# EAGLE design BMW_final (EAGLE 6.4)
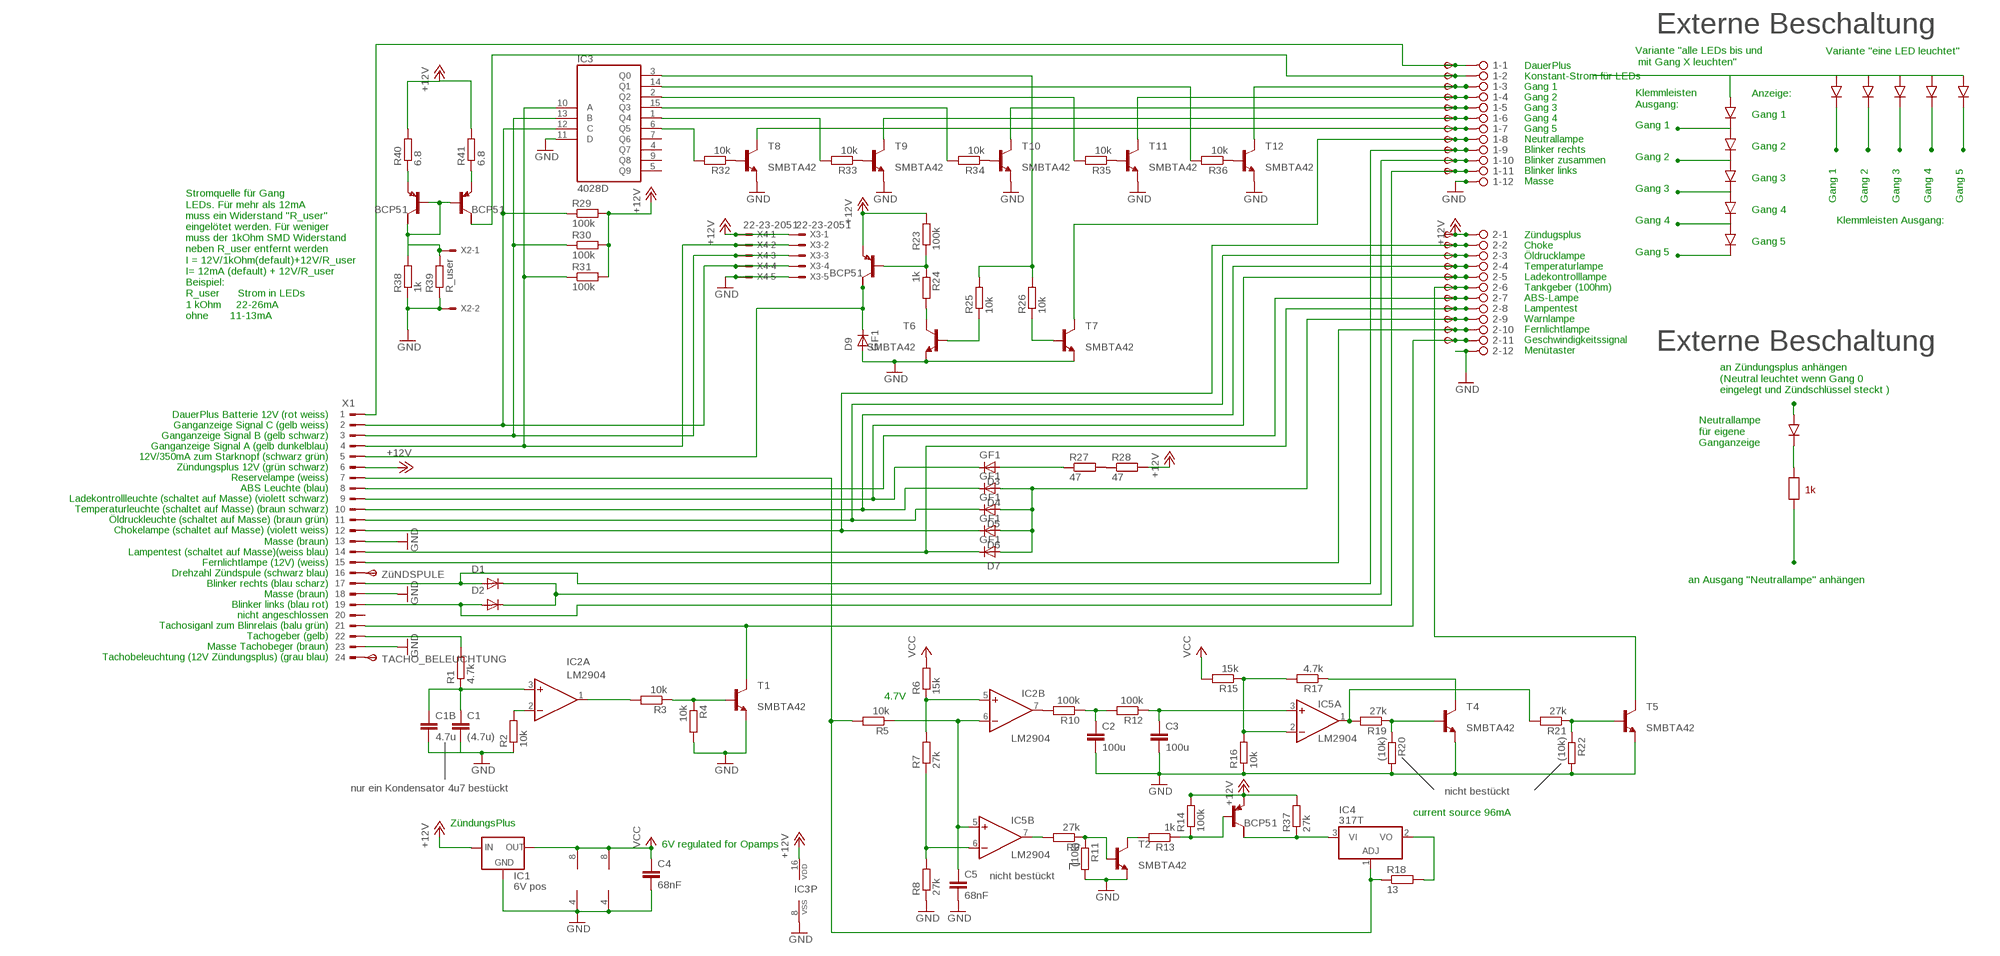
[diagram p0: schematic, sheet 1]

## Parts
1  2081-1132  [12-PIN]
2  2081-1132  [12-PIN]
C1  (4.7u)  C-EUC1206  [C1206]
C1B  4.7u  C-EUC0805K  [C0805K]
C2  100u  C-EUC1206K  [C1206K]
C3  100u  C-EUC1206K  [C1206K]
C4  68nF  C-EUC1206K  [C1206K]
C5  68nF  C-EUC1206K  [C1206K]
D1  GF1  [SMA-DO214AC]
D2  GF1  [SMA-DO214AC]
D3  GF1  [SMA-DO214AC]
D4  GF1  [SMA-DO214AC]
D5  GF1  [SMA-DO214AC]
D6  GF1  [SMA-DO214AC]
D7  GF1  [SMA-DO214AC]
D9  GF1  [SMA-DO214AC]
IC1  6V pos  78LXX  [78LXX]
IC2  LM2904  LM358D  [SO08]
IC3  4028D  [SO16]
IC4  317T  [TO220H]
IC5  LM2904  LM358D  [SO08]
R1  4.7k  R-EU_R0805  [R0805]
R2  10k  R-EU_R0805  [R0805]
R3  10k  R-EU_R0805  [R0805]
R4  10k  R-EU_R0805  [R0805]
R5  10k  R-EU_R0805  [R0805]
R6  15k  R-EU_R0805  [R0805]
R7  27k  R-EU_R0805  [R0805]
R8  27k  R-EU_R0805  [R0805]
R9  27k  R-EU_R0805  [R0805]
R10  100k  R-EU_R0805  [R0805]
R11  (10k)  R-EU_R0805  [R0805]
R12  100k  R-EU_R0805  [R0805]
R13  1k  R-EU_R0805  [R0805]
R14  100k  R-EU_R0805  [R0805]
R15  15k  R-EU_R0805  [R0805]
R16  10k  R-EU_R0805  [R0805]
R17  4.7k  R-EU_R0805  [R0805]
R18  13  R-EU_0207/10  [0207/10]
R19  27k  R-EU_R0805  [R0805]
R20  (10k)  R-EU_R0805  [R0805]
R21  27k  R-EU_R0805  [R0805]
R22  (10k)  R-EU_R0805  [R0805]
R23  100k  R-EU_R0805  [R0805]
R24  1k  R-EU_R0805  [R0805]
R25  10k  R-EU_R0805  [R0805]
R26  10k  R-EU_R0805  [R0805]
R27  47  R-EU_V235/17  [V235/17]
R28  47  R-EU_V235/17  [V235/17]
R29  100k  R-EU_R0805  [R0805]
R30  100k  R-EU_R0805  [R0805]
R31  100k  R-EU_R0805  [R0805]
R32  10k  R-EU_R0805  [R0805]
R33  10k  R-EU_R0805  [R0805]
R34  10k  R-EU_R0805  [R0805]
R35  10k  R-EU_R0805  [R0805]
R36  10k  R-EU_R0805  [R0805]
R37  27k  R-EU_R0805  [R0805]
R38  1k  R-EU_R0805  [R0805]
R39  R_user  R-EU_R0805  [R0805]
R40  6.8  R-EU_R0805  [R0805]
R41  6.8  R-EU_R0805  [R0805]
T  BCP53T1  [SOT223]
T1  MMBTA42LT1-NPN-SOT23-BEC  [SOT23-BEC]
T2  MMBTA42LT1-NPN-SOT23-BEC  [SOT23-BEC]
T3  BCP53T1  [SOT223]
T4  MMBTA42LT1-NPN-SOT23-BEC  [SOT23-BEC]
T5  MMBTA42LT1-NPN-SOT23-BEC  [SOT23-BEC]
T6  MMBTA42LT1-NPN-SOT23-BEC  [SOT23-BEC]
T7  MMBTA42LT1-NPN-SOT23-BEC  [SOT23-BEC]
T8  MMBTA42LT1-NPN-SOT23-BEC  [SOT23-BEC]
T9  MMBTA42LT1-NPN-SOT23-BEC  [SOT23-BEC]
T10  MMBTA42LT1-NPN-SOT23-BEC  [SOT23-BEC]
T11  MMBTA42LT1-NPN-SOT23-BEC  [SOT23-BEC]
T12  MMBTA42LT1-NPN-SOT23-BEC  [SOT23-BEC]
T13  BCP53T1  [SOT223]
T14  BCP53T1  [SOT223]
TACHO_BELEUCHTUNG  TPSP1_1MM  [P1_1.0MM]
TP1  TPSB1,27  [B1,27]
TP2  TPSB1,27  [B1,27]
TP3  TPSB1,27  [B1,27]
TP4  TPSB1,27  [B1,27]
TP5  TPSB1,27  [B1,27]
TP6  TPSB1,27  [B1,27]
TP7  TPSB1,27  [B1,27]
TP8  TPSB1,27  [B1,27]
TP9  TPSB1,27  [B1,27]
TP10  TPSB1,27  [B1,27]
TP11  TPSB1,27  [B1,27]
TP12  TPSB1,27  [B1,27]
TP16  TPSB1,27  [B1,27]
TP17  TPSB1,27  [B1,27]
TP18  TPSB1,27  [B1,27]
TP19  TPSB1,27  [B1,27]
TP21  TPSB1,27  [B1,27]
TP22  TPSB1,27  [B1,27]
TP23  TPSB1,27  [B1,27]
TP24  TPSB1,27  [B1,27]
TP25  TPSB1,27  [B1,27]
TP26  TPSB1,27  [B1,27]
X1  CON_BMW  [24-PIN]
X2  22-23-2021  [22-23-2021]
X3  22-23-2051  [22-23-2051]
X4  22-23-2051  [22-23-2051]
ZüNDSPULE  TPSP1_1MM  [P1_1.0MM]

## Nets
+12V: 2.1 IC1.IN IC3.16(VDD) R14.2 R23.2 R28.2 R29.2 R30.2 R31.2 R37.2 R40.2 R41.2 T3.3(E) T.3(E) TP12.TP(PP) X1.6 X3.1 X4.1
GND: 1.12 2.12 C1.2 C1B.2 C2.2 C3.2 C4.2 C5.2 D9.A IC1.GND IC2.4(P:V-) IC3.8(VSS) IC3.11(D) IC5.4(P:V-) R2.1 R4.2 R8.1 R11.2 R16.1 R20.2 R22.2 R38.1 R39.1 T1.E T2.E T4.E T5.E T6.E T7.E T8.E T9.E T10.E T11.E T12.E X1.13 X1.18 X1.23 X2.2 X3.5 X4.5
N$1: 2.9 D4.A D5.A D6.A D7.A TP24.TP(PP)
N$2: IC3.10(A) R31.1 X1.4 X3.2 X4.2
N$3: IC3.13(B) R30.1 X1.3 X3.3 X4.3
N$4: 2.7 TP22.TP(PP) X1.8
N$5: R25.1 T6.B
N$6: IC3.3(Q0) R25.2 R26.2
N$7: R24.2 T6.C
N$8: R27.2 R28.1
N$9: R23.1 R24.1 T.1(B)
N$10: R26.1 T7.B
N$11: D9.K(C) T.2(C) X1.5
N$12: 2.2 D6.K(C) TP16.TP(PP) X1.12
N$13: 2.3 D5.K(C) TP17.TP(PP) X1.11
N$14: 2.4 D4.K(C) TP18.TP(PP) X1.10
N$15: IC4.1(ADJ) R5.2 R18.1 X1.7
N$16: C5.1 IC2.6(B:-IN) IC5.5(B:+IN) R5.1
N$17: IC3.12(C) R29.1 X1.2 X3.4 X4.4
N$18: R32.1 T8.B
N$19: 2.8 D7.K(C) TP23.TP(PP) X1.14
N$20: 1.9 D1.A TP9.TP(PP) X1.17
N$21: 1.11 D2.A TP11.TP(PP) X1.19
N$22: 1.10 D1.K(C) D2.K(C) TP10.TP(PP)
N$23: R1.2 X1.22
N$24: C1.1 C1B.1 IC2.3(A:+IN) R1.1
N$25: IC2.2(A:-IN) R2.2
N$26: 2.11 T1.C TP26.TP(PP) X1.21
N$27: IC2.1(A:OUT) R3.2
N$28: R3.1 R4.1 T1.B
N$29: IC4.2(VO) R18.2
N$30: IC5.6(B:-IN) R7.1 R8.2
N$31: IC5.7(B:OUT) R9.2
N$32: R13.2 T2.C
N$34: R9.1 R11.1 T2.B
N$35: IC4.3(VI) R37.1 T3.2(C)
N$36: R13.1 R14.1 T3.1(B)
N$37: IC3.14(Q1) R36.2
N$38: IC3.2(Q2) R35.2
N$39: 1.5 T10.C TP5.TP(PP)
N$40: IC2.5(B:+IN) R6.1 R7.2
N$41: IC2.7(B:OUT) R10.2
N$42: X1.16 ZüNDSPULE.TP(PP)
N$43: IC5.1(A:OUT) R19.2 R21.2
N$44: R19.1 R20.1 T4.B
N$45: C2.1 R10.1 R12.2
N$46: C3.1 IC5.3(A:+IN) R12.1
N$47: IC5.2(A:-IN) R15.1 R16.2 R17.2
N$48: R21.1 R22.1 T5.B
N$49: R17.1 T4.C
N$50: 1.6 T9.C TP6.TP(PP)
N$51: R34.1 T10.B
N$52: 1.8 T7.C TP8.TP(PP)
N$53: 2.10 TP25.TP(PP) X1.15
N$54: D3.A R27.1
N$55: 2.5 D3.K(C) TP19.TP(PP) X1.9
N$56: R33.1 T9.B
N$57: R35.1 T11.B
N$58: TACHO_BELEUCHTUNG.TP(PP) X1.24
N$59: 1.2 T14.2(C) TP2.TP(PP)
N$60: 2.6 T5.C TP21.TP(PP)
N$61: IC3.6(Q5) R32.2
N$62: R36.1 T12.B
N$63: 1.7 T8.C TP7.TP(PP)
N$64: IC3.1(Q4) R33.2
N$65: IC3.15(Q3) R34.2
N$66: 1.4 T11.C TP4.TP(PP)
N$67: 1.3 T12.C TP3.TP(PP)
N$68: R38.2 R39.2 T13.1(B) T13.2(C) T14.1(B) X2.1
N$69: 1.1 TP1.TP(PP) X1.1
N$75: R40.1 T13.3(E)
N$83: R41.1 T14.3(E)
VCC: C4.1 IC1.OUT IC2.8(P:V+) IC5.8(P:V+) R6.2 R15.2
Unconnected: IC3.4(Q7) IC3.5(Q9) IC3.7(Q6) IC3.9(Q8) T3.4(C/) T13.4(C/) T14.4(C/) T.4(C/) X1.20

## Notes on the sheet
- Externe Beschaltung
- Variante "eine LED leuchtet"
- Variante "alle LEDs bis und
   mit Gang X leuchten"
- Anzeige:
- Klemmleisten
  Ausgang:
- Gang 1
- DauerPlus
  Konstant-Strom für LEDs
  Gang 1
  Gang 2
  Gang 3
  Gang 4
  Gang 5
  Neutrallampe
  Blinker rechts
  Blinker zusammen
  Blinker links
  Masse
- Gang 1
- Gang 2
- Gang 2
- Gang 3
- Gang 3
- Gang 1 | Gang 2 | Gang 3 | Gang 4 | Gang 5
- Gang 4
- Gang 4 | Klemmleisten Ausgang:
- Gang 5
- Gang 5
- Zündugsplus
  Choke
  Öldrucklampe
  Temperaturlampe
  Ladekontrolllampe
  Tankgeber (100hm)
  ABS-Lampe
  Lampentest
  Warnlampe
  Fernlichtlampe
  Geschwindigkeitssignal
  Menütaster
- Stromquelle für Gang
  LEDs. Für mehr als 12mA
  muss ein Widerstand "R_user"
  eingelötet werden. Für weniger
  muss der 1kOhm SMD Widerstand
  neben R_user entfernt werden
  I = 12V/1kOhm(default)+12V/R_user
  I= 12mA (default) + 12V/R_user
  Beispiel:
  R_user      Strom in LEDs
  1 kOhm     22-26mA
  ohne       11-13mA
- Externe Beschaltung
- an Zündungsplus anhängen
  (Neutral leuchtet wenn Gang 0
  eingelegt und Zündschlüssel steckt )
- Neutrallampe
  für eigene
  Ganganzeige
- DauerPlus Batterie 12V (rot weiss)
  Ganganzeige Signal C (gelb weiss)
  Ganganzeige Signal B (gelb schwarz)
  Ganganzeige Signal A (gelb dunkelblau)
  12V/350mA zum Starknopf (schwarz grün)
  Zündungsplus 12V (grün schwarz)
  Reservelampe (weiss)
  ABS Leuchte (blau)
  Ladekontrollleuchte (schaltet auf Masse) (violett schwarz)
  Temperaturleuchte (schaltet auf Masse) (braun schwarz)
  Öldruckleuchte (schaltet auf Masse) (braun grün)
  Chokelampe (schaltet auf Masse) (violett weiss)
- 1k
- an Ausgang "Neutrallampe" anhängen
- Masse (braun)
  Lampentest (schaltet auf Masse)(weiss blau)
  Fernlichtlampe (12V) (weiss)
  Drehzahl Zündspule (schwarz blau)
  Blinker rechts (blau scharz)
  Masse (braun)
  Blinker links (blau rot)
  nicht angeschlossen
  Tachosiganl zum Blinrelais (balu grün)
  Tachogeber (gelb)
  Masse Tachobeger (braun)
  Tachobeleuchtung (12V Zündungsplus) (grau blau)
- 4.7V
- nur ein Kondensator 4u7 bestückt
- nicht bestückt
- current source 96mA
- ZündungsPlus
- 6V regulated for Opamps
- nicht bestückt

## Library data of the parts
1 2 = con WAGO BMW:2081-1132: WAGO SREW CLAMP
C1 C1B C2-C5 = rcl:C-EU: CAPACITOR, European symbol
D1-D7 D9 = diode:GF1: DIODE
IC1 = v-reg:78LXX: VOLTAGE REGULATOR
IC2 = linear:LM358: OP AMP also LM158; LM258; LM2904 Source: http://cache.national.com/ds/LM/LM158.pdf; IC: LM2904
IC3 = 40xx:4028: BCD to decimal DECODER
IC4 = linear_BMW:*317: Positive VOLTAGE REGULATOR
IC5 = linear_BMW:LM358: OP AMP also LM158; LM258; LM2904 Source: http://cache.national.com/ds/LM/LM158.pdf
R1-R41 = rcl:R-EU_: RESISTOR, European symbol
T T3 T13 T14 = BCP53_:BCP53*; T: BCP51
T1 T2 T4-T12 = transistor:*-NPN-: NPN Transistror BF959 corrected 2008.03.06; T: SMBTA42
TACHO_BELEUCHTUNG TP1-TP12 TP16-TP19 TP21-TP26 ZüNDSPULE = testpin_BMW:TPS: TEST PIN
X1 = con_BMW:CON_BMW: BMW CONNECTOR
X2 = con-molex:22-23-2021: .100" (2.54mm) Center Header - 2 Pin; MF: MOLEX; MPN: 22-23-2021; OC_FARNELL: 1462926; OC_NEWARK: 25C3832
X3 X4 = con-molex:22-23-2051: .100" (2.54mm) Center Header - 5 Pin; MF: MOLEX; MPN: 22-23-2051; OC_FARNELL: 1462952; OC_NEWARK: 38C9178

## Board
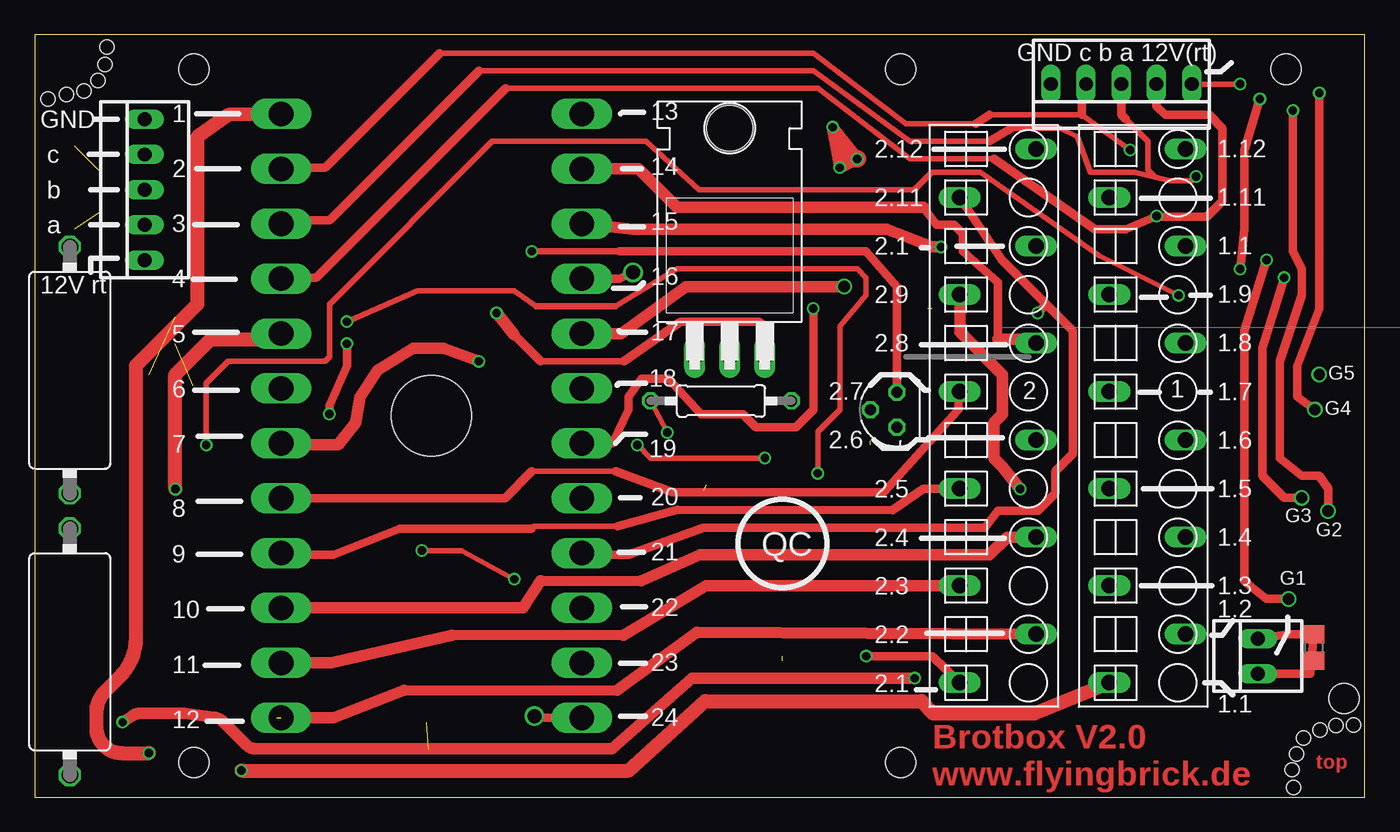
[diagram p1: board, top side]
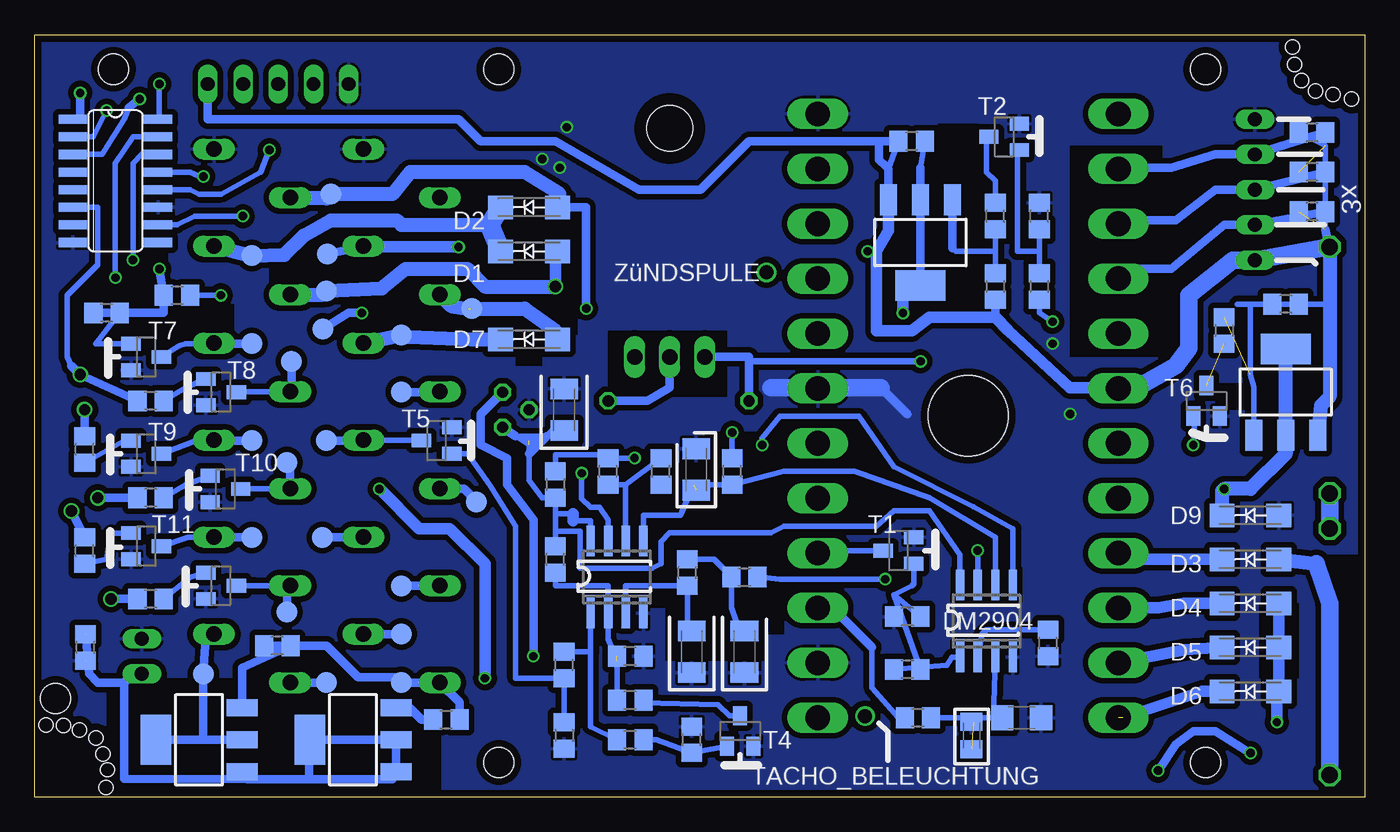
[diagram p2: board, bottom side, seen from below]

Size 96 x 55 mm. Coordinates in mm from the lower left corner, seen from the top.
Outline: 0,0 96,0 96,55 0,55 0,0
Copper layers (1*16): Top 0.035mm / dielectric 1.5mm / Bottom 0.035mm
Design rules "multi-cb_035um-cu *": minimum track width 6mil, minimum drill 12mil, track to track 16mil, track to pad 20mil, pad to pad 16mil, via to via 16mil, smd to smd 16mil, copper to edge 20mil, drill to drill 8mil, minimum pad ring 8mil, minimum via ring 6mil, stop-mask expansion 3mil, vias tented up to drill 0mil, thermal gap 8mil
Holes 5.8 mm at 28.64,27.5
Holes 2.18 mm at 11.5,52.5 62.5,52.5 11.5,2.5 62.5,2.5 90.3,52.5 94.5,7.1
Holes 1.02 mm at 0.95,50.36 2.29,50.67 3.56,50.93 4.57,51.69 5.21,54.1 95.19,5.21 93.92,5.14 92.77,4.83 91.06,3.11 90.74,1.97 90.87,0.7 91.57,4.25 5.08,52.83
bRestrict: area 27.9,35.9 to 30.8,48.6; area 14.6,31.8 to 21.3,47; area 47.9,21 to 52.7,23.8; area 43.2,9.8 to 50.5,14; area 41.9,11.7 to 43.8,14; area 49.8,13.7 to 51.8,14.9; area 42.2,23.8 to 47.6,26.4; area 59.4,31.1 to 61.3,33.3; area 46,28.9 to 54.6,33.7; area 66.7,0.6 to 90.8,8.6; area 2.9,25.1 to 8.3,31.1; area 56.8,33.3 to 58.7,37.1; 10 more areas

### Footprints (pad centres in the part's own frame; a part is rotated, then mirrored left to right if it is on the bottom)
12-PIN = drill 1.118 long: 1 19.25,-2.45; 2 15.75,3.05; 3 12.25,-2.45; 4 8.75,3.05; 5 5.25,-2.45; 6 1.75,3.05; 7 -1.75,-2.45; 8 -5.25,3.05; 9 -8.75,-2.45; 10 -12.25,3.05; 11 -15.75,-2.45; 12 -19.25,3.05
C1206 = smd 1.6 x 1.8: 1 -1.4,0; 2 1.4,0
C0805K = smd 1.3 x 1.6: 1 -1,0; 2 1,0
C1206K = smd 1.5 x 2: 1 -1.5,0; 2 1.5,0
SMA-DO214AC = smd 1.8 x 1.7: A -2.05,0; K 2.05,0
78LXX = drill 0.813 octagon: GND 0,1.905; IN 1.27,0; OUT -1.27,0
SO08 = smd 0.6 x 2.2: 1 -1.905,-2.6; 2 -0.635,-2.6; 3 0.635,-2.6; 4 1.905,-2.6; 5 1.905,2.6; 6 0.635,2.6; 7 -0.635,2.6; 8 -1.905,2.6
SO16 = smd 0.66 x 2.032: 1 -4.445,-3.073; 2 -3.175,-3.073; 3 -1.905,-3.073; 4 -0.635,-3.073; 5 0.635,-3.073; 6 1.905,-3.073; 7 3.175,-3.073; 8 4.445,-3.073; 9 4.445,3.073; 10 3.175,3.073; 11 1.905,3.073; 12 0.635,3.073; 13 -0.635,3.073; 14 -1.905,3.073; 15 -3.175,3.073; 16 -4.445,3.073
TO220H = drill 1.118 long: 1 -2.54,-10.16; 2 0,-10.16; 3 2.54,-10.16 | hole 3.302: 0,6.326
R0805 = smd 1.3 x 1.5: 1 -0.95,0; 2 0.95,0
0207/10 = drill 0.813 octagon: 1 -5.08,0; 2 5.08,0
V235/17 = drill 1.194 octagon: 1 -8.89,0; 2 8.89,0
SOT223 = smd 1.219 x 2.235: 1 -2.311,-3.099; 2 0,-3.099; 3 2.311,-3.099 | smd 3.6 x 2.2: 4 0,3.099
SOT23-BEC = smd 1 x 1.4: B -0.95,-1.1; C 0,1.1; E 0.95,-1.1
P1_1.0MM = drill 1.016: TP 0,0
B1,27 = smd 1.5 x 1.5: TP 0,0
24-PIN = drill 1.778 long: 1 -21.78,-10.85; 2 -17.82,-10.85; 3 -13.86,-10.85; 4 -9.9,-10.85; 5 -5.94,-10.85; 6 -1.98,-10.85; 7 1.98,-10.85; 8 5.94,-10.85; 9 9.9,-10.85; 10 13.86,-10.85; 11 17.82,-10.85; 12 21.78,-10.85; 13 -21.78,10.85; 14 -17.82,10.85; 15 -13.86,10.85; 16 -9.9,10.85; 17 -5.94,10.85; 18 -1.98,10.85; 19 1.98,10.85; 20 5.94,10.85; 21 9.9,10.85; 22 13.86,10.85; 23 17.82,10.85; 24 21.78,10.85
22-23-2021 = drill 1 long: 1 -1.27,0; 2 1.27,0
22-23-2051 = drill 1 long: 1 -5.08,0; 2 -2.54,0; 3 0,0; 4 2.54,0; 5 5.08,0

### Placement (x,y rotation side)
1  80.01,27.5 270 top
2  69.22,27.5 270 top
C1  24.77,5.71 0 bottom
C1B  28.38,4.45 90 bottom
C2  44.77,10.48 270 bottom
C3  48.58,10.48 270 bottom
C4  57.78,27.94 90 bottom
C5  48.26,23.62 90 bottom
D1  60.33,39.37 180 bottom
D2  60.33,42.55 180 bottom
D3  8.26,17.14 180 bottom
D4  8.26,13.97 180 bottom
D5  8.26,10.79 180 bottom
D6  8.26,7.62 180 bottom
D7  60.33,33.02 180 bottom
D9  8.26,20.32 180 bottom
IC1  62.23,27.94 90 top
IC2  27.3,12.7 0 bottom
IC3  90.17,44.45 270 bottom
IC4  50.16,41.91 0 top
IC5  53.98,15.88 0 bottom
R1  32.26,5.71 180 bottom
R2  22.86,11.11 90 bottom
R3  33.02,9.21 180 bottom
R4  33.02,13.02 180 bottom
R5  45.66,23.5 90 bottom
R6  58.42,22.54 270 bottom
R7  54.61,23.5 90 bottom
R8  50.8,23.5 90 bottom
R9  23.5,36.83 270 bottom
R10  44.77,15.88 0 bottom
R11  23.5,41.91 90 bottom
R12  48.9,16.19 90 bottom
R13  26.67,41.91 90 bottom
R14  26.67,36.83 270 bottom
R15  58.42,17.14 90 bottom
R16  53.02,10.16 180 bottom
R17  53.02,6.99 180 bottom
R18  49.53,28.57 0 top
R19  53.02,4.13 180 bottom
R20  48.58,4.13 90 bottom
R21  57.78,9.53 90 bottom
R22  57.78,4.45 270 bottom
R23  5.71,35.56 180 bottom
R24  10.16,33.66 270 bottom
R25  85.72,36.2 180 bottom
R26  90.81,34.92 180 bottom
R27  2.54,10.48 90 top
R28  2.54,30.8 90 top
R29  3.81,47.94 180 bottom
R30  3.81,45.09 180 bottom
R31  3.81,42.23 180 bottom
R32  87.63,28.57 180 bottom
R33  92.39,25.08 90 bottom
R34  87.63,21.59 180 bottom
R35  92.39,17.78 90 bottom
R36  87.63,14.29 180 bottom
R37  32.7,47.31 180 bottom
R38  92.33,10.79 90 bottom
R39  92.33,10.79 90 top
R40  66.29,5.59 0 bottom
R41  78.49,10.92 180 bottom
T  5.71,29.21 0 bottom
T1  33.66,17.78 90 bottom
T2  26.04,47.62 90 bottom
T3  32.07,40.01 180 bottom
T4  45.09,4.76 0 bottom
T5  66.99,25.72 90 bottom
T6  11.43,28.57 0 bottom
T7  87.95,31.75 270 bottom
T8  82.55,29.21 270 bottom
T9  87.95,24.77 270 bottom
T10  82.23,22.23 270 bottom
T11  87.95,18.1 270 bottom
T12  82.55,15.24 270 bottom
T13  73.03,4.13 90 bottom
T14  84.14,4.13 90 bottom
TACHO_BELEUCHTUNG  36.07,5.84 0 bottom
TP1  74.93,8.26 0 bottom
TP2  83.82,8.89 0 bottom
TP3  77.79,13.34 0 bottom
TP4  80.33,18.73 0 bottom
TP5  77.79,24.13 0 bottom
TP6  80.33,25.72 0 bottom
TP7  77.47,31.43 0 bottom
TP8  80.33,32.7 0 bottom
TP9  74.93,36.51 0 bottom
TP10  80.33,39.05 0 bottom
TP11  74.61,43.5 0 bottom
TP12  69.53,8.26 0 bottom
TP16  69.53,11.75 0 bottom
TP17  69.53,15.24 0 bottom
TP18  75.25,18.73 0 bottom
TP19  64.14,21.27 0 bottom
TP21  74.93,25.72 0 bottom
TP22  69.53,29.21 0 bottom
TP23  69.53,33.34 0 bottom
TP24  64.45,35.24 0 bottom
TP25  74.87,39.18 0 bottom
TP26  75.18,33.78 0 bottom
X1  28.64,27.5 270 top
X2  88.27,10.16 90 top
X3  78.42,51.44 180 top
X4  7.94,43.81 90 top
ZüNDSPULE  43.18,37.85 0 bottom

### Tracks (layer width: path | path; a pad name or v marks a point on that pad's centre or on a via)
+12V  (via drill 0.6)  (2 unrouted)
  Top 0.406: v87,51.44 X3.1
  Top 0.457: 42.23,39.37 v35.88,39.37
  Top 0.61: 2.1 64.78,10.15 v60.01,10.16 | IC1.IN 62.23,36.83 60.01,39.37 42.23,39.37
  Bottom 0.406: R23.2 2.54,35.56 | 34.38,45.31 R37.2 | R29.2 2.86,46.99 2.86,40.96 | 2.54,39.37 R28.2 | IC3.16 87,48.9 v87,51.44
  Bottom 0.61: T3.3 34.38,45.31 | R14.2 26.67,34.61 | v60.01,10.16 60.01,20 61.91,22.54 61.91,24.45 63.82,25.4 63.82,27.62 IC1.IN | 2.86,40.96 2.54,39.37 | R37.2 44.45,47.31 47.94,43.81 52.39,43.81 58.42,47.31 63.82,47.31 65.41,48.9 83.5,48.9 X3.1 | v35.88,39.37 35.24,39.37 | R40.2 65.34,6.83 2.1 TP12.TP 69.91,8.64 72.64,8.64 74.93,10.92 R41.2
  Bottom 0.813: T3.3 34.38,40.87 35.24,39.37 35.24,33.66 32.7,33.66 31.43,34.61 26.67,34.61 25.72,33.66 21.27,29.53 18.79,29.53 X1.6
  Bottom 1.016: R28.2 2.54,35.56 2.54,28.88 3.17,28.25 T.3
  Bottom 1.27: R28.2 X4.1 9.53,38.73 12.7,36.2 12.7,32.38 13.65,31.11 15.89,29.84 X1.6
GND  (via drill 0.6)  (1 unrouted)
  Top 0.61: X2.2 90.49,11.75 92.08,11.75 | v21.27,27.62 21.27,28.26 22.54,31.11 v22.54,32.7
  Top 0.813: v58.1,45.4 v57.59,48.32 v59.37,46.04 v58.1,45.4
  Top 1.27: v59.37,46.04 59.05,46.04 58.42,46.67
  Bottom 0.61: 33.02,27.62 34.92,29.53
  Bottom 1.27: 34.92,29.53 42.86,29.53
  pour Bottom: 0,55.24 95.89,55.24 95.89,0 0,0
N$1  (via drill 0.6)  (1 unrouted)
  Top 0.813: 2.9 66.77,33.56 69.85,30.48 69.85,27.62 69.22,26.99 69.22,24.45 69.85,23.81 v71.12,22.23 | v6.35,5.4 7.08,5.88 arc-34 7.57,6.03 10.79,6.03 12.95,5.76 arc-38 13.61,5.44 15.35,3.7 arc45 15.85,3.49 41.66,3.49 47.43,8.57 v63.5,8.57
  Bottom 0.813: v71.12,22.23 68.26,19.37 66.04,19.37 63.5,16.83 v63.5,8.57 | D4.A D5.A D6.A 6.35,7.47 v6.35,5.4
  Bottom 1.016: D7.A 58.42,33.63 60.64,35.24 64.77,35.24 65.9,35.42 65.94,35.42 2.9
N$2  (via drill 0.6)
  Top 0.406: 33.97,51.12 56.52,51.12 63.18,46.04 69.22,46.04
  Top 0.61: X1.4 17.85,37.47 20.32,37.47 33.97,51.12 | 69.22,46.04 76.52,40.96 78.74,40.96 v80.96,41.91 81.03,41.85 84.58,41.85 85.72,42.99 85.72,48.26 84.77,49.21 81.6,49.21 80.96,49.85 X3.2
  Bottom 0.406: v80.96,41.91 84.45,41.91 85.72,41.27 IC3.10
  Bottom 0.61: R31.1 X4.2 10.16,41.27 13.97,38.1 17.09,38.1 X1.4
N$3  (via drill 0.6)
  Top 0.406: 32.07,52.39 56.2,52.39 63.18,47.31 68.9,47.31 | 70.48,48.26 73.98,48.26 75.25,47.62 76.2,45.09 79.38,45.09 80.87,44.71 | v83.82,44.77 83.5,44.45 81.92,44.45 80.87,44.71 | 78.74,48.9 80.33,47.31 80.33,45.25 80.87,44.71
  Top 0.61: X1.3 18.02,41.59 21.27,41.59 32.07,52.39 | 68.9,47.31 70.48,48.26 | X3.3 78.42,49.21 78.74,48.9
  Bottom 0.406: IC3.13 84.77,45.09 84.14,44.77 v83.82,44.77
  Bottom 0.61: R30.1 X4.3 10.79,43.81 13.65,41.59 17.55,41.59 X1.3
N$4
  Top 0.406: 35.88,23.5 41.91,23.5
  Top 0.61: X1.8 33.94,21.56 35.88,23.5 | 41.91,23.5 46.04,21.97 61.28,21.97 66.67,27.94 66.67,29.16 2.7
  Bottom 0.61: TP22.TP 66.81,29.21 2.7
N$5  (via drill 0.6)
  Top 0.406: v12.38,25.4 12.38,29.84 13.97,31.43 20.95,31.43 21.27,31.75 21.27,35.56 33.02,47.31 44.13,47.31 47.94,43.81 63.5,43.81 64.77,45.09 68.26,45.09 76.83,39.05 v82.55,36.2
  Bottom 0.406: T6.B 12.23,27.62 v12.38,25.4 | v82.55,36.2 R25.1
N$6  (via drill 0.6)
  Top 0.61: v87,38.1 87.31,40.96 87.31,46.67 v88.42,50.37
  Bottom 0.406: IC3.3 91.12,46.35 89.53,48.9 89.22,49.73
  Bottom 0.61: R26.2 86.67,34.92 R25.2 v87,38.1 | v88.42,50.37 89.22,49.73
N$7  (1 unrouted)
N$8
  Bottom 1.27: R27.2 R28.1
N$9  (1 unrouted)
  Bottom 0.406: R23.1 8.26,35.56 | 8.26,35.56 9.21,35.56 | T.1 8.03,29.62 8.26,30.48 8.26,35.56
N$10
  Bottom 0.406: T7.B 91.58,32.7 R26.1
N$11  (via drill 0.6)
  Top 1.016: v10.16,22.23 10.16,30.48 12.7,33.02 17.36,33.02 X1.5
  Bottom 1.016: D9.K 10.3,22.08 v10.16,22.23 8.26,22.23 5.71,24.77 T.2 5.71,31.75
N$12  (1 unrouted)
  Top 0.711: 26.67,7.7 42.04,7.7
  Top 0.813: X1.12 21.59,5.71 26.67,7.7 | 42.04,7.7 47.82,11.88 2.2
  Bottom 0.61: 17.46,5.71 18.41,5.71 | TP16.TP 2.2
  Bottom 0.813: D6.K 11.75,7.62 17.46,5.71
N$13
  Top 0.711: 42.49,11.67 30.11,11.67
  Top 0.813: 2.3 66.75,15.24 48.45,15.24 42.49,11.67 | 30.11,11.67 21.43,9.68 X1.11
  Bottom 0.61: TP17.TP 2.3
  Bottom 0.813: D5.K 13,10.63 X1.11
N$14
  Top 0.711: 36.51,15.61 43.81,15.61
  Top 0.813: X1.10 17.8,13.65 35.24,13.65 36.51,15.61 | 43.81,15.61 48.01,17.46 68.9,17.46 70.19,18.75 2.4
  Bottom 0.61: TP18.TP 72.28,18.73 2.4
  Bottom 0.813: D4.K 13.02,13.97 14.91,13.64 X1.10
N$15  (via drill 0.6)
  Top 0.406: 17.91,25.4 X1.7 | v45.66,26.29 R18.1
  Top 0.813: v32.07,31.43 29.53,32.38 27.3,32.38 24.77,30.8 23.5,28.89 23.18,26.99 21.91,25.4 17.91,25.4
  Bottom 0.406: R5.2 v45.66,26.29
  Bottom 0.457: 44.45,31.43 v32.07,31.43
  Bottom 0.61: IC4.1 44.45,31.75 44.45,31.43 R18.1
N$16  (1 unrouted)
  Bottom 0.406: IC5.5 52.07,20.32 49.4,20.32 48.45,22.54 R5.1 41.91,23.5 36.83,23.5 31.43,21.59 26.67,18.73 IC2.6
N$17  (via drill 0.6)
  Top 0.406: 29.21,53.66 56.2,53.66 62.87,48.58 67.94,48.58 | v79.06,46.67 75.56,49.21 68.9,49.21
  Top 0.61: X1.2 17.87,45.4 20.95,45.4 29.21,53.66 | 67.94,48.58 68.9,49.21 | X3.4 75.56,51.44 75.56,49.21
  Bottom 0.406: IC3.12 84.77,43.81 84.14,43.5 82.55,43.5 79.69,45.09 v79.06,46.67
  Bottom 0.61: R29.1 X4.4 10.79,46.35 13.97,45.4 17.7,45.4 X1.2
N$18
  Bottom 0.406: R32.1 85.09,29.52 T8.B
N$19
  Top 0.61: 64.14,42.55 65.09,41.27 66.36,41.27 66.99,40.64 66.99,39.37 69.53,37.15 69.53,33.02 | 72.53,33.02 2.8
  Top 0.813: X1.14 43.58,45.32 46.35,42.55 64.14,42.55 | 69.53,33.02 72.53,33.02
  Bottom 1.016: 2.8 TP23.TP 69.39,33.19 69.05,33.19 64.45,33.02 D7.K
N$20  (via drill 0.81)
  Top 0.813: X1.17 42.33,33.44 46.99,36.83 v58.42,36.83
  Bottom 0.61: 58.42,39.23 D1.A
  Bottom 0.813: v58.42,36.83 58.42,39.23
  Bottom 1.016: 1.9 75.19,36.25 TP9.TP 70.94,36.69 69.22,38.1 64.77,38.1 63.5,36.83 v58.42,36.83
N$21  (via drill 0.6)
  Top 0.61: X1.19 41.71,25.52 42.86,27.94 42.86,28.89 43.81,30.16 45.76,30.16 48.09,27.62 51.12,27.62 52.07,26.67 54.93,26.67 56.2,27.94 v56.2,35.24
  Bottom 0.61: D2.A 56.2,42.55 v56.2,35.24
  Bottom 1.016: D2.A 58.12,43.52 60.64,45.09 68.9,45.09 70.17,43.5 TP11.TP 74.93,43.18 76.8,43.18 1.11
N$22
  Bottom 1.016: 1.10 TP10.TP 77.98,39.12 76.59,40.51 74.61,41.59 69.85,41.59 69.53,41.27 63.16,41.27
  Bottom 1.422: D1.K 63.16,41.27 D2.K
N$23
  Bottom 0.406: R1.2 33.66,5.71 35.56,7.87 35.56,10.79 | 37.78,13.02 38.86,13.02 X1.22
  Bottom 0.61: 35.56,10.79 37.78,13.02
N$24  (1 unrouted)
  Bottom 0.406: IC2.3 26.8,5.66 C1.1 28.57,5.71 | 28.57,5.71 28.89,5.71 | 28.89,5.71 28.26,5.4 28.57,5.71 | 28.89,5.71 R1.1
N$25
  Bottom 0.406: IC2.2 27.62,11.75 27.31,12.06 R2.2
N$26  (via drill 0.6)
  Top 0.61: 2.11 69.78,38.8 73.03,35.56 | 73.03,35.56 74.93,33.66 74.93,24.77 73.66,23.5 73.66,21.91 72.39,20.64 69.53,20.64 68.58,19.43 48.26,19.43 42.86,17.46 39.62,17.46 X1.21 | v72.39,34.92 73.03,35.56
  Bottom 0.406: T1.C 37.4,17.78 X1.21
  Bottom 0.61: TP26.TP 73.34,34.92 v72.39,34.92
N$27
  Bottom 0.406: IC2.1 29.79,10.1 30.16,9.53 R3.2
N$28
  Bottom 0.406: R4.1 33.97,14.6 | 33.97,14.6 R3.1 | T1.B 32.55,15.39 32.7,15.24 33.97,14.6
N$29
  Bottom 0.61: R18.2 51.75,28.57 50.16,29.53 IC4.2
N$30
  Bottom 0.406: R7.1 53.34,22.55 | 53.34,22.55 R8.2 | IC5.6 53.34,22.55
N$31  (via drill 0.6)
  Top 0.406: v56.52,23.36 56.52,26.35 58.1,27.94 58.1,33.97 60.01,36.2 60.01,37.47 59.37,38.1 46.35,38.1 41.91,35.4 | 36.2,35.4 34.61,36.51 27.62,36.51 v22.54,34.29
  Top 0.457: 41.91,35.4 36.2,35.4
  Bottom 0.406: IC5.7 54.61,20 55.24,20.89 55.88,20.89 56.52,21.53 v56.52,23.36 | v22.54,34.29 23.5,34.92 R9.2
N$32
  Bottom 0.406: R13.2 26.67,44.45 27.3,45.09 27.3,47.45
  Bottom 0.61: 27.3,47.45 T2.C
N$33
  Bottom 0.61: 88.14,8.89 88.9,8.89 89.66,8.13
N$34
  Bottom 0.406: T2.B 25.08,46.67 25.08,39.37 23.5,39.37 | 23.5,39.37 R11.1 | R9.1 23.5,39.37
N$35  (via drill 0.6)
  Top 0.457: 42.55,31.43 36.51,31.43
  Top 0.61: IC4.3 52.83,33.97 52.26,34.29 46.61,34.29 42.55,31.43 | 34.61,33.34 36.51,31.43
  Top 0.813: v33.34,34.92 34.61,33.34
  Bottom 0.406: 32.07,45.4 R37.1
  Bottom 0.61: 32.07,36.83 T3.2 32.07,45.4
  Bottom 0.813: 32.07,36.83 33.34,36.83 v33.34,34.92
N$36
  Bottom 0.406: 29.76,39.6 29.53,39.37 26.67,39.37 R13.1 R14.1
  Bottom 0.61: T3.1 29.76,39.6
N$37  (via drill 0.6, 0.81)
  Top 0.61: v90.49,14.29 88.9,14.29 87.31,15.56 87.31,33.66 v88.9,38.73
  Bottom 0.406: v88.9,38.73 88.9,45.72 88.27,46.35 IC3.14
  Bottom 0.61: R36.2 v90.49,14.29
N$38  (via drill 0.6, 0.81)
  Top 0.61: v90.81,49.53 90.81,39.37 91.44,38.1 91.44,36.2 89.85,31.43 89.85,24.45 91.44,23.18 92.71,23.18 93.34,22.23 v93.34,20.64
  Bottom 0.406: IC3.2 91.76,47.62 v90.81,49.53
  Bottom 0.61: v93.34,20.64 R35.2
N$39
  Bottom 0.406: T10.C 80.16,22.25 1.5
  Bottom 0.61: 1.5 77.56,23.9 TP5.TP
N$40  (via drill 0.6)
  Top 0.406: v52.7,24.45 44.45,24.45 v43.5,25.4
  Bottom 0.406: R6.1 58.42,24.68 55.25,24.68 R7.2 v52.7,24.45 | IC2.5 25.4,19.37 28.26,20.95 33.97,23.81 36.51,27.46 42.23,27.46 43.5,25.88 v43.5,25.4
N$41  (via drill 0.6)
  Top 0.406: v34.61,15.72 30.8,17.78 v27.94,17.78
  Bottom 0.406: R10.2 42.23,15.72 v34.61,15.72 | v27.94,17.78 IC2.7
N$42
  Top 0.61: X1.16 42.23,37.4 ZüNDSPULE.TP
N$43
  Bottom 0.406: IC5.1 55.88,10.48 | 55.88,10.48 R21.2 | R19.2 55.88,5.08 55.88,10.48
N$44
  Bottom 0.406: T4.B R20.1 51.12,4.13 R19.1
N$45
  Bottom 0.406: R12.2 46.99,17.14 R10.1 45.72,13.65 45.4,12.7 C2.1
N$46
  Bottom 0.406: IC5.3 53.34,15.24 R12.1 48.9,12.38 48.58,12.06 C3.1
N$47  (1 unrouted)
  Bottom 0.406: R15.1 58.42,15.24 54.61,15.24 IC5.2 54.61,11.43 53.98,9.84 R17.2
N$48
  Bottom 0.406: R22.1 R21.1 61.28,8.57 61.28,19.52 63.18,22.54 64.77,24.77 T5.B
N$49
  Bottom 0.406: T4.C 45.87,5.86 46.67,6.67 52.22,6.82 R17.1
N$50
  Bottom 0.406: T9.C 84.28,25.75 1.6
  Bottom 0.61: TP6.TP 83.03,25.72 1.6
N$51
  Bottom 0.406: R34.1 85.09,22.54 T10.B
N$52
  Bottom 0.406: 1.8 83.11,32.7 85.09,32.7 85.58,32.55 T7.C
  Bottom 0.61: TP8.TP 83.01,32.7 1.8
N$53  (via drill 0.6)
  Top 0.813: X1.15 43.18,40.96 61.51,40.96 64.77,39.69 v65.41,39.69
  Bottom 0.61: TP25.TP 72.2,39.69
  Bottom 0.813: v65.41,39.69 72.2,39.69 2.10
N$54
  Bottom 1.016: D3.A 3.49,16.83
  Bottom 1.27: 3.49,16.83 2.54,13.97 R27.1
N$55
  Top 0.406: 42.07,19.53 36.04,19.53 35.88,19.37
  Top 0.61: 2.5 64.14,22.25 61.91,20.7 46.38,20.73 42.07,19.53 | X1.9 17.92,17.46 21.59,17.46 26.35,19.37 35.88,19.37
  Bottom 0.61: TP19.TP 64.14,21.36 65.02,22.25 2.5
  Bottom 0.813: D3.K 17.79,17.14 X1.9
N$56
  Bottom 0.406: R33.1 89.54,25.71 T9.B
N$57
  Bottom 0.406: R35.1 90.81,17.14 90.49,19.05 T11.B
N$58
  Top 0.61: X1.24 36.45,5.72 TACHO_BELEUCHTUNG.TP
N$59
  Bottom 0.61: T14.2 83.82,4.13 | 83.82,4.13 86.68,4.13 | 1.2 83.69,11.55 83.69,10.92 TP2.TP 83.82,4.13
N$60
  Bottom 0.406: 2.6 68.76,25.75 T5.C
  Bottom 0.61: TP21.TP 72.3,25.72 2.6
N$61  (via drill 0.81)
  Bottom 0.406: 93.34,31.11 93.66,31.75 93.66,36.2 91.44,38.42 91.44,42.55 IC3.6
  Bottom 0.61: R32.2 v92.71,30.48 93.34,31.11
N$62
  Bottom 0.406: R36.1 84.78,15.87 T12.B
N$63
  Bottom 0.406: T8.C 80.78,29.25 1.7
  Bottom 0.61: TP7.TP 77.47,29.34 1.7
N$64  (via drill 0.6, 0.81)
  Top 0.61: v92.39,27.94 91.12,28.89 91.12,31.11 92.71,35.24 v92.71,50.8
  Bottom 0.61: R33.2 v92.39,27.94 | v92.71,50.8 92.71,48.9 IC3.1
N$65  (via drill 0.6, 0.81)
  Top 0.61: v91.44,21.59 90.17,21.59 88.58,23.18 88.58,32.38 v90.17,37.47
  Bottom 0.406: v90.17,37.47 90.17,45.72 88.9,47.62 IC3.15
  Bottom 0.61: R34.2 v91.44,21.59
N$66
  Bottom 0.406: T11.C 84.92,18.75 1.4
  Bottom 0.61: TP4.TP 83.04,18.73 1.4
N$67
  Bottom 0.406: T12.C 80.17,15.25 1.3
  Bottom 0.61: TP3.TP 77.79,15.02 1.3
N$68  (1 unrouted)
  Top 0.61: X2.1 92.08,8.89 R39.2
  Bottom 0.61: T13.1 70.26,1.5 | R39.2 92.08,8.89 91.44,8.26 89.53,8.26 89.53,1.33 80.64,1.27 80.42,1.5 T14.1 80.49,1.27 76.2,1.27 | 76.2,4.13 T13.2 T13.1 | 76.2,1.27 70.16,1.27 T13.1 | 76.2,1.27 76.2,3.17
N$69  (via drill 0.6)
  Top 1.016: X1.1 13.97,49.21 11.75,47.62 11.75,35.56 7.3,31.11 7.3,11.51 arc-45 6.13,8.67 5.1,7.64 arc45 4.45,6.05 4.45,5.03 arc90 6.3,3.17 v8.26,3.17 | v14.92,1.91 42.86,1.91 48.39,6.92 64.01,6.92 64.83,6.03 72.16,6.03 1.1
  Bottom 0.61: v8.26,3.17 10.79,4.76 12.38,4.76 13.65,3.81 v14.92,1.91 | TP1.TP 1.1
N$70
  Bottom 0.61: 35.05,47.24 35.05,45.97 34.54,45.47
N$75
  Bottom 0.61: T13.3 68.92,6.44 68.07,5.59 R40.1
N$83
  Bottom 0.61: T14.3 81.04,9.32 R41.1
VCC  (2 unrouted)
  Bottom 0.406: R15.2 58.42,19.18 | 58.42,19.18 58.42,20.19 58.42,20.45 | 58.42,20.45 R6.2 59.37,21.59 60.33,22.86 60.33,23.18 60.33,25.4 IC1.OUT | 61.28,26.03 59.06,26.03 58.42,26.67 C4.1 | IC2.8 29.21,17.46 31.43,20.64 33.97,20.64 35.24,19.53 41.91,19.53 42.86,19.05 50.16,19.05 50.8,18.41 50.8,16.83 51.44,16.51 56.64,16.51 56.64,19.18 58.42,19.18 | IC5.8 55.88,19.94 57.15,19.94 | 57.15,20.45 58.42,20.45
  Bottom 0.61: IC1.OUT 61.28,26.03 | 59.05,26.04 60.33,24.77 | 59.37,25.72 60.33,25.72
  Bottom 0.813: 57.15,19.94 57.15,20.45

### Text on the board
Top: top | Brotbox V2.0 / www.flyingbrick.de
tPlace: G5 | G4 | G3 | G2 | QC | G1
tNames: GND c b a 12V(rt) | GND / c / b / a | 12V rt | 18 | 19 | 2.7 / 2.6 | 8 | 1.12 / 1.11 / 1.1 / 1.9 / 1.8 / 1.7 / 1.6 / 1.5 / 1.4 / 1.3 | 1.2 | 1.1 | 1 / 2 / 3 / 4 / 5 / 6 / 7 / / 9 / 10 / 11 / 12 | 2.12 / 2.11 / 2.1 / 2.9 / 2.8 / / / 2.5 / 2.4 / 2.3 / 2.2 / 2.1 | 13 / 14 / 15 / 16 / 17 / / / 20 / 21 / 22 / 23 / 24
bNames: 3x | LM2904
tStop: Brotbox V2.0 / www.flyingbrick.de
tDocu: +12v